# Altium schematic sheet temperature_measurement.SchDoc: Temperature Measurement
size A4; Author: AJ; DrawnBy: AJ; Engineer: AJ; DocumentNumber: 4; Revision: 005; SheetNumber: 4; SheetTotal: 6; PageSetup: Record=PageOptions|CenterHorizontal=True|CenterVertical=True|PrintScale=1.00|XCorrection=1.00|YCorrection=1.00|PrintKind=0|BorderSize=5000000|LeftOffset=0|BottomOffset=0|Orientation=2|PaperLength=1000|PaperWidth=1000|Scale=100|PaperSource=7|PrintQuality=-4|MediaType=1|DitherType=10|PaperKind=A4|PrintScaleMode=0; Description: Thermocouple interfaces, on-board temperature sensor and ADC.
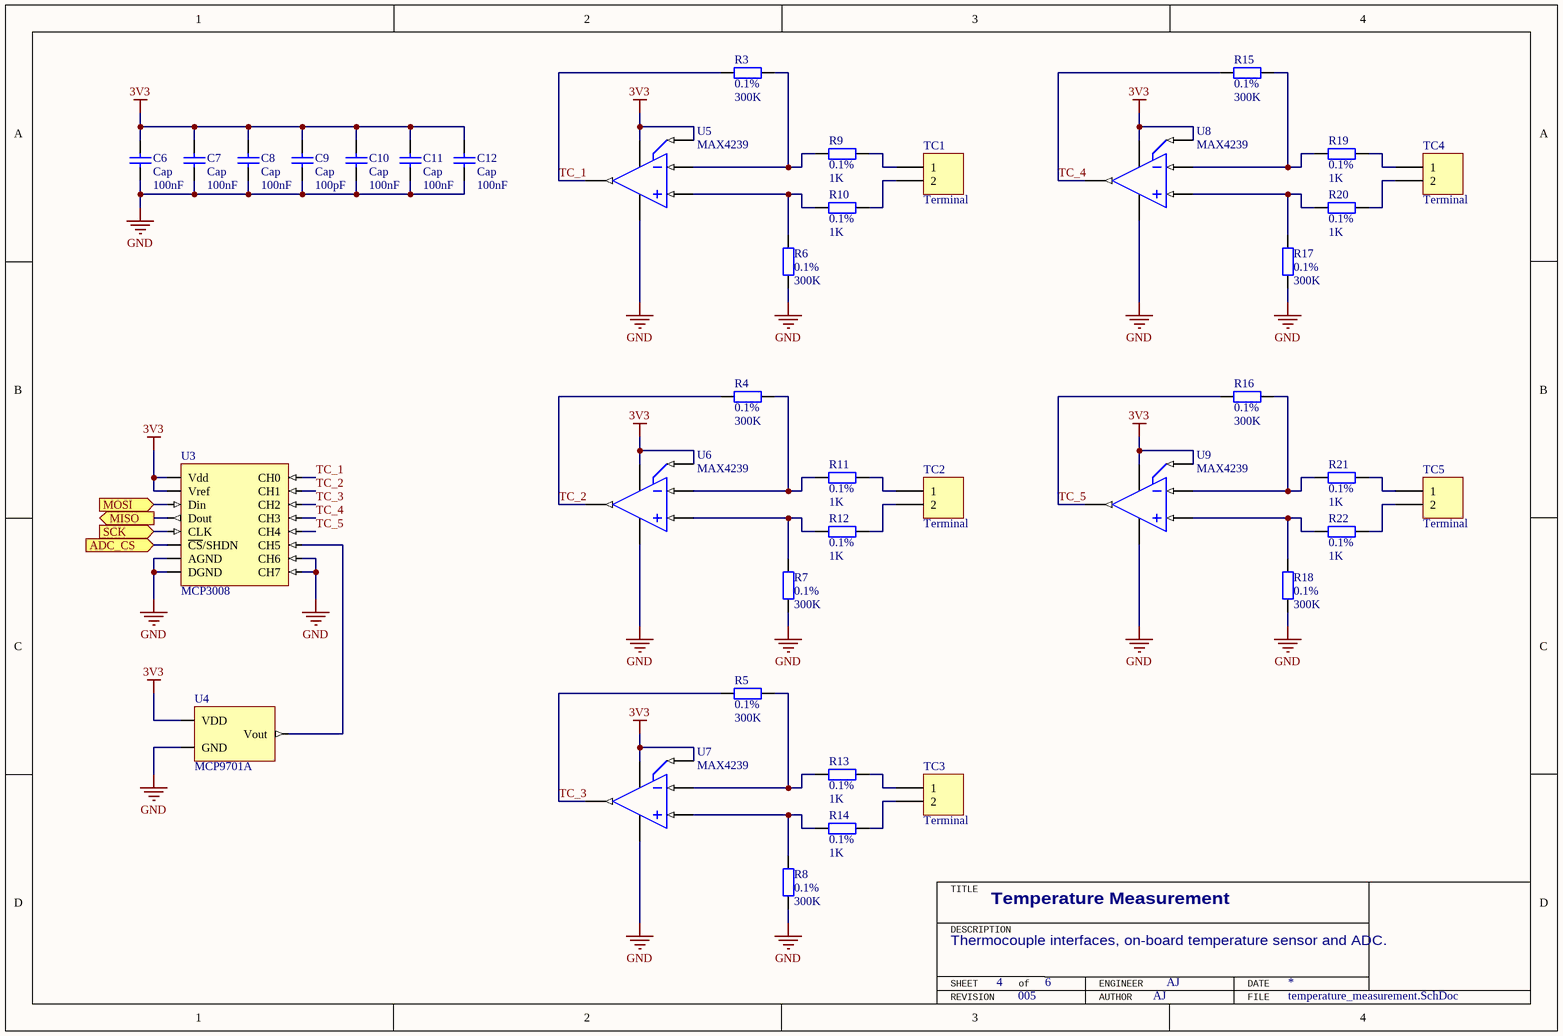
[diagram p0: temperature_measurement.SchDoc]

## Parts
C6  Cap  value 100nF  [0603]
C7  Cap  value 100nF  [0603]
C8  Cap  value 100nF  [0603]
C9  Cap  value 100pF  [0603]
C10  Cap  value 100nF  [0603]
C11  Cap  value 100nF  [0603]
C12  Cap  value 100nF  [0603]
R3  0.1%  value 300K  [0603]
R4  0.1%  value 300K  [0603]
R5  0.1%  value 300K  [0603]
R6  0.1%  value 300K  [0603]
R7  0.1%  value 300K  [0603]
R8  0.1%  value 300K  [0603]
R9  0.1%  value 1K  [0603]
R10  0.1%  value 1K  [0603]
R11  0.1%  value 1K  [0603]
R12  0.1%  value 1K  [0603]
R13  0.1%  value 1K  [0603]
R14  0.1%  value 1K  [0603]
R15  0.1%  value 300K  [0603]
R16  0.1%  value 300K  [0603]
R17  0.1%  value 300K  [0603]
R18  0.1%  value 300K  [0603]
R19  0.1%  value 1K  [0603]
R20  0.1%  value 1K  [0603]
R21  0.1%  value 1K  [0603]
R22  0.1%  value 1K  [0603]
TC1  Terminal  [Terminal Block]
TC2  Terminal  [Terminal Block]
TC3  Terminal  [Terminal Block]
TC4  Terminal  [Terminal Block]
TC5  Terminal  [Terminal Block]
U3  MCP3008  [SO-16]
U4  MCP9701A  [SC-70]
U5  MAX4239  [SO-8]
U6  MAX4239  [SO-8]
U7  MAX4239  [SO-8]
U8  MAX4239  [SO-8]
U9  MAX4239  [SO-8]

## Ports
ADC_CS (in), MISO (out), MOSI (in), SCK (in)

## Nets
3V3: C6.2 C7.2 C8.2 C9.2 C10.2 C11.2 C12.2 U3.15(Vref) U3.16(Vdd) U4.4(VDD) U5.1(~{SHDN}) U5.7(Vcc) U6.1(~{SHDN}) U6.7(Vcc) U7.1(~{SHDN}) U7.7(Vcc) U8.1(~{SHDN}) U8.7(Vcc) U9.1(~{SHDN}) U9.7(Vcc)
GND: C6.1 C7.1 C8.1 C9.1 C10.1 C11.1 C12.1 R6.1 R7.1 R8.1 R17.1 R18.1 U3.7(CH6) U3.8(CH7) U3.9(DGND) U3.14(AGND) U4.2(GND) U5.4(GND) U6.4(GND) U7.4(GND) U8.4(GND) U9.4(GND)
ADC_CS: U3.10(~{CS}/SHDN) ; port ADC_CS
MISO: U3.12(Dout) ; port MISO
MOSI: U3.11(Din) ; port MOSI
SCK: U3.13(CLK) ; port SCK
TC_1: R3.1 U3.1(CH0) U5.6(OUT)
TC_2: R4.1 U3.2(CH1) U6.6(OUT)
TC_3: R5.1 U3.3(CH2) U7.6(OUT)
TC_4: R15.1 U3.4(CH3) U8.6(OUT)
TC_5: R16.1 U3.5(CH4) U9.6(OUT)
NetR3_2: R3.2 R9.2 U5.2(IN-)
NetR4_2: R4.2 R11.2 U6.2(IN-)
NetR5_2: R5.2 R13.2 U7.2(IN-)
NetR6_2: R6.2 R10.2 U5.3(IN+)
NetR7_2: R7.2 R12.2 U6.3(IN+)
NetR8_2: R8.2 R14.2 U7.3(IN+)
NetR9_1: R9.1 TC1.1
NetR10_1: R10.1 TC1.2
NetR11_1: R11.1 TC2.1
NetR12_1: R12.1 TC2.2
NetR13_1: R13.1 TC3.1
NetR14_1: R14.1 TC3.2
NetR15_2: R15.2 R19.2 U8.2(IN-)
NetR16_2: R16.2 R21.2 U9.2(IN-)
NetR17_2: R17.2 R20.2 U8.3(IN+)
NetR18_2: R18.2 R22.2 U9.3(IN+)
NetR19_1: R19.1 TC4.1
NetR20_1: R20.1 TC4.2
NetR21_1: R21.1 TC5.1
NetR22_1: R22.1 TC5.2
NetU3_6: U3.6(CH5) U4.3(Vout)

## Notes on the sheet
- TITLE
- DESCRIPTION
- SHEET
- of
- ENGINEER
- DATE
- REVISION
- AUTHOR
- FILE

## Library data of the parts
C6-C12 = Cap: Capacitor; Published: 8-Jun-2000; LatestRevisionDate: 17-Jul-2002; LatestRevisionNote: Re-released for DXP Platform.; PackageReference: RAD-0.3; Publisher: Altium Limited
R3-R22 = Res2: Resistor; Published: 8-Jun-2000; LatestRevisionDate: 17-Jul-2002; LatestRevisionNote: Re-released for DXP Platform.; PackageReference: AXIAL-0.4; Publisher: Altium Limited
TC1-TC5 = Header 2: Header, 2-Pin; LatestRevisionDate: 17-Jul-2002; LatestRevisionNote: Re-released for DXP Platform.; Publisher: Altium Limited
U3 = MCP3008: ADC 8-channel 10-bit
U4 = MCP9701A: Low-Power Linear Active Thermistor
U5-U9 = MAX4239: Ultra-Low Offset/Drift, Low-Noise,  Precision SOT23 Amplifiers